# Altium schematic sheet 电源.SchDoc: 电源
size A4; DocumentNumber: 6; Revision: 樊浩柏; SheetNumber: 6; SheetTotal: 6
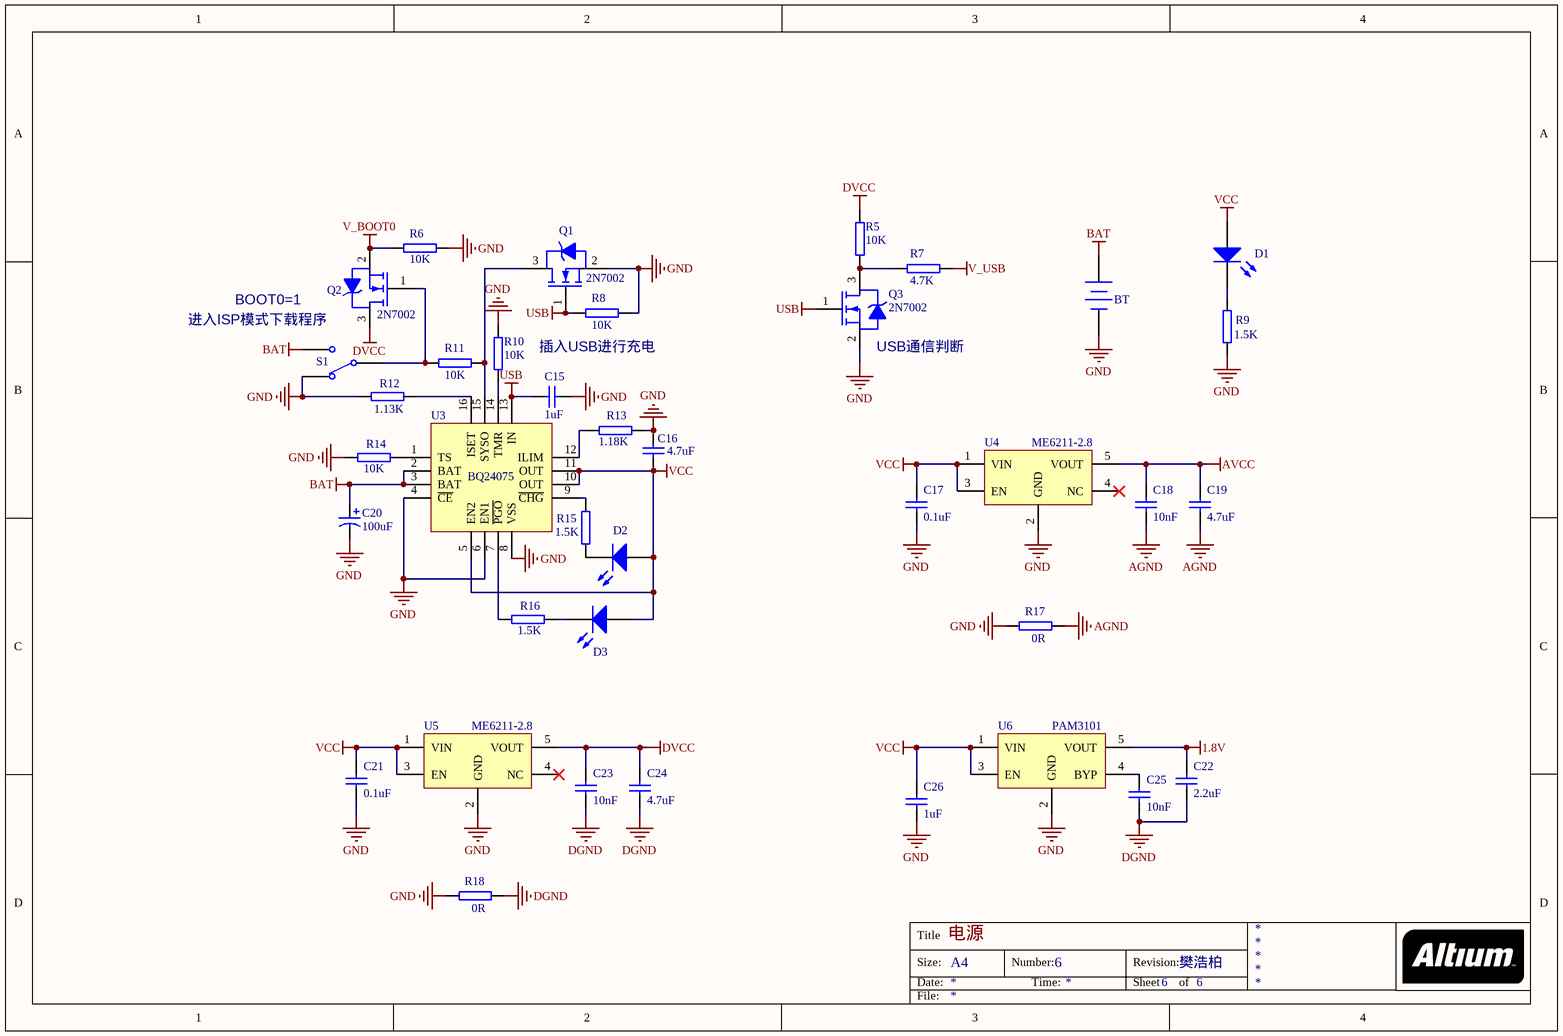
[diagram p0: 电源.SchDoc]

## Parts
BT  Battery  [Header-2.0-SMD]  (value not drawn)
C15  1uF  [CAP-0402]
C16  4.7uF  [CAP-0402]
C17  0.1uF  [CAP-0402]
C18  10nF  [CAP-0402]
C19  4.7uF  [CAP-0402]
C20  100uF  [CASE-A_3216-18]
C21  0.1uF  [CAP-0402]
C22  2.2uF  [CAP-0402]
C23  10nF  [CAP-0402]
C24  4.7uF  [CAP-0402]
C25  10nF  [CAP-0402]
C26  1uF  [CAP-0402]
D1  LED  [LED-BLU-0603]  (value not drawn)
D2  LED  [LED-BLU-0603]  (value not drawn)
D3  LED  [LED-RED-0603]  (value not drawn)
Q1  2N7002  [SOT-23-3-L]
Q2  2N7002  [SOT-23-3-L]
Q3  2N7002  [SOT-23-3-L]
R5  10K  [RES-0402]
R6  10K  [RES-0402]
R7  4.7K  [RES-0402]
R8  10K  [RES-0402]
R9  1.5K  [RES-0402]
R10  10K  [RES-0402]
R11  10K  [RES-0402]
R12  1.13K  [RES-0402]
R13  1.18K  [RES-0402]
R14  10K  [RES-0402]
R15  1.5K  [RES-0402]
R16  1.5K  [RES-0402]
R17  0R  [RES-0402]
R18  0R  [RES-0402]
S1  Key-3  [SW-MSK-12C02]  (value not drawn)
U3  BQ24075  [QFN-16-3x3MM]
U4  ME6211-2.8  [SOT-23-5]
U5  ME6211-2.8  [SOT-23-5]
U6  PAM3101  [SOT-23-5]

## Nets
1.8V: C22.1 U6.5(VOUT)
AGND: C18.2 C19.2 R17.1
AVCC: C18.1 C19.1 U4.5(VOUT)
BAT: BT.1(+) C20.A S1.1 U3.2(BAT) U3.3(BAT)
DGND: C22.2 C23.2 C24.2 C25.2 R18.1
DVCC: C23.1 C24.1 Q2.3(D) R5.1 U5.5(VOUT)
GND: BT.2(-) C15.2 C16.1 C17.2 C20.K C21.2 C26.2 Q1.2(S) Q3.2(S) R6.1 R8.1 R9.1 R10.2 R12.1 R13.1 R14.1 R17.2 R18.2 S1.3 U3.4(~{CE}) U3.6(EN1) U3.8(VSS) U4.2(GND) U5.2(GND) U6.2(GND)
USB: C15.1 Q1.1(G) Q3.1(G) R8.2 U3.13(IN)
V_BOOT0: Q2.2(S) R6.2
V_USB: R7.2
VCC: C16.2 C17.1 C21.1 C26.1 D1.A D2.A D3.A U3.5(EN2) U3.10(OUT) U3.11(OUT) U4.1(VIN) U4.3(EN) U5.1(VIN) U5.3(EN) U6.1(VIN) U6.3(EN)
NetC25_1: C25.1 U6.4(BYP)
NetD1_K: D1.K R9.2
NetD2_K: D2.K R15.1
NetD3_K: D3.K R16.2
NetQ1_3: Q1.3(D) R11.1 U3.15(SYSO)
NetQ2_1: Q2.1(G) R11.2 S1.2
NetQ3_3: Q3.3(D) R5.2 R7.1
NetR10_1: R10.1 U3.14(TMR)
NetR12_2: R12.2 U3.16(ISET)
NetR13_2: R13.2 U3.12(ILIM)
NetR14_2: R14.2 U3.1(TS)
NetR15_2: R15.2 U3.9(~{CHG})
NetR16_1: R16.1 U3.7(~{PGO})

Not connected (* = marked no-connect by the designer): U4 4(NC)*; U5 4(NC)*

## Notes on the sheet
- BOOT0=1
- 进入ISP模式下载程序
- 插入USB进行充电
- (near Q3) USB通信判断
- Title
- Size:
- Date:
- A4
- Number:
- Time:
- Revision:
- Sheet
- of
- File:

## Library data of the parts
C15-C19 C21-C26 = Cap
C20 = Cap-Pol_1
Q1-Q3 = N-MOS
R5-R18 = Res
U4 U5 = LDO: Published: 24-Mar-1999; LatestRevisionDate: 29-May-2009; LatestRevisionNote: IPC-7351 Footprint Added.; PackageReference: D2PAK; Publisher: Altium Limited; PackageDescription: 3-Pin Transistor Outline Package 2.54 mm Pitch, 15.1 mm Lead Span